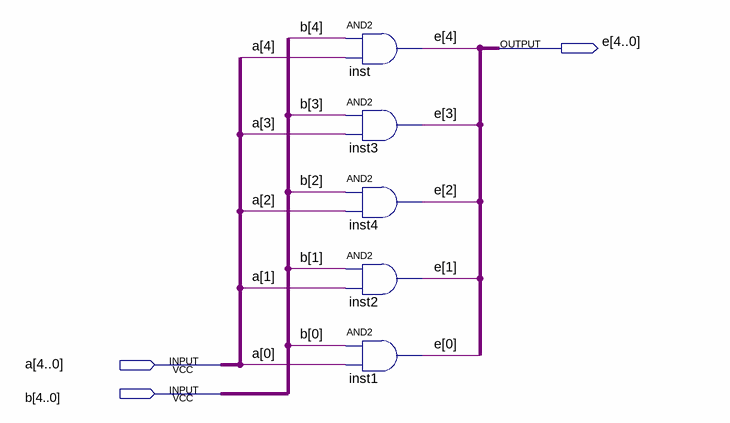
[diagram p0: schematic sheet]
// Quartus schematic and_5bits.bdf as structural Verilog: 5 symbols, 3 pins
module and_5bits (
  input  [4:0] a,
  input  [4:0] b,
  output [4:0] e
);

  and inst (e[4], b[4], a[4]);
  and inst3 (e[3], b[3], a[3]);
  and inst4 (e[2], b[2], a[2]);
  and inst2 (e[1], b[1], a[1]);
  and inst1 (e[0], b[0], a[0]);
endmodule
